# EAGLE design pcb-bldc-servo (EAGLE 9.6.2)
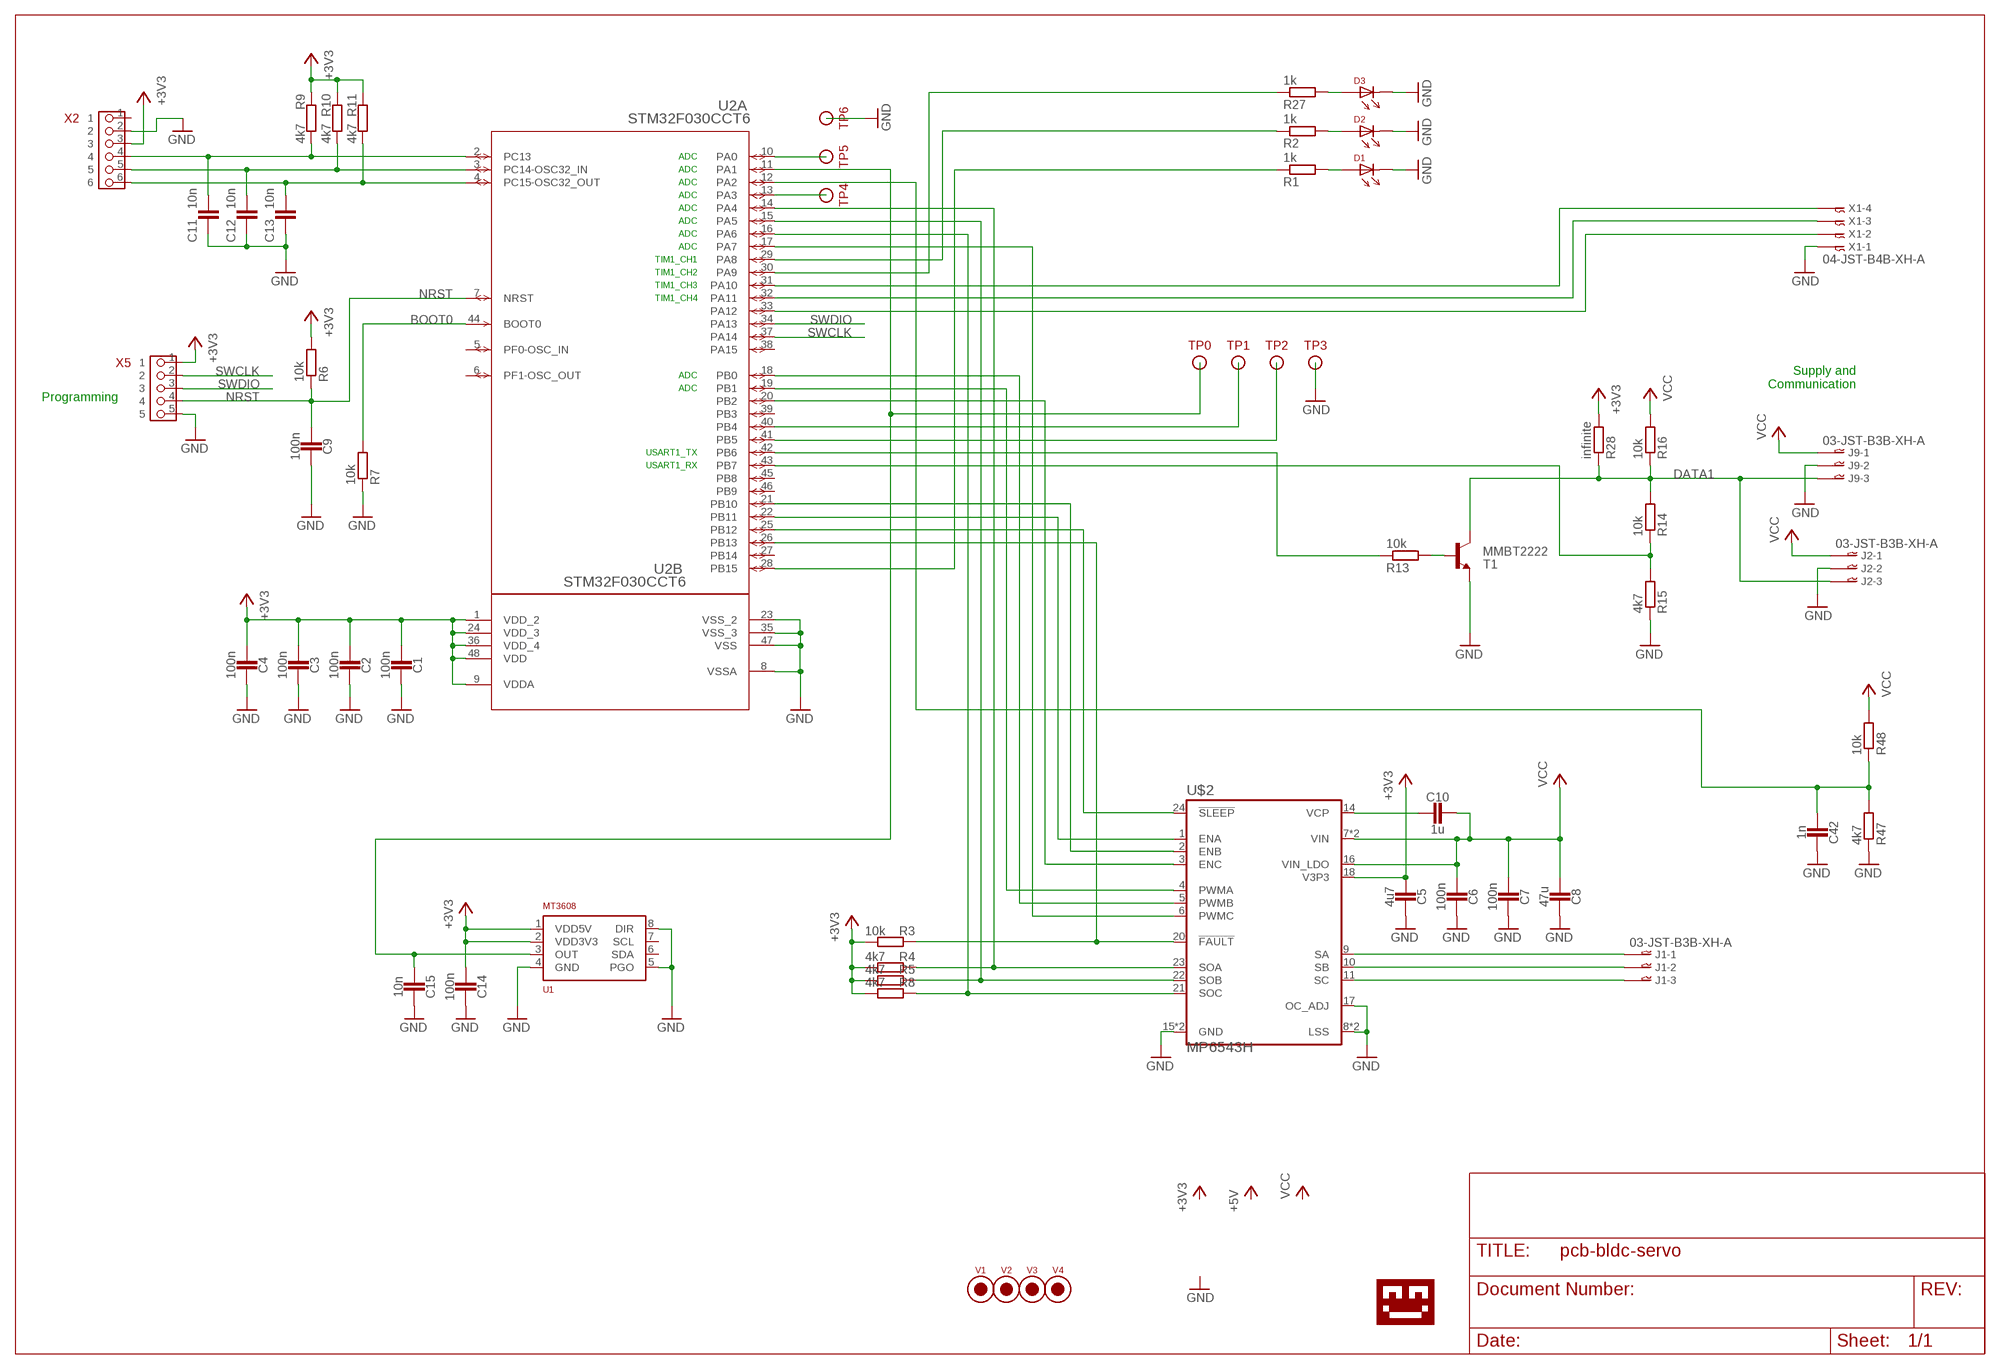
[diagram p0: schematic, sheet 1]

## Parts
C1  100n  CAPACITOR0603_CAP  [0603_CAP]
C2  100n  CAPACITOR0603_CAP  [0603_CAP]
C3  100n  CAPACITOR0603_CAP  [0603_CAP]
C4  100n  CAPACITOR0603_CAP  [0603_CAP]
C5  4u7  CAPACITOR0805_CAP  [0805_CAP]
C6  100n  CAPACITOR0603_CAP  [0603_CAP]
C7  100n  CAPACITOR0603_CAP  [0603_CAP]
C8  47u  CAPACITOR1210_CAP  [1210_CAP]
C9  100n  CAPACITOR0603_CAP  [0603_CAP]
C10  1u  CAPACITOR0603_CAP  [0603_CAP]
C11  10n  CAPACITOR0603_CAP  [0603_CAP]
C12  10n  CAPACITOR0603_CAP  [0603_CAP]
C13  10n  CAPACITOR0603_CAP  [0603_CAP]
C14  100n  CAPACITOR0603_CAP  [0603_CAP]
C15  10n  CAPACITOR0603_CAP  [0603_CAP]
C42  1n  CAPACITOR0603_CAP  [0603_CAP]
D1  LED-0805  [0805-DOT]
D2  LED-0805  [0805-DOT]
D3  LED-0805  [0805-DOT]
J1  03-JST-B3B-XH-A  [B3B-XH]
J2  03-JST-B3B-XH-A  [B3B-XH]
J9  03-JST-B3B-XH-A  [B3B-XH]
R1  1k  RESISTOR0603_RES  [0603-RES]
R2  1k  RESISTOR0603_RES  [0603-RES]
R3  10k  RESISTOR0603_RES  [0603-RES]
R4  4k7  RESISTOR0603_RES  [0603-RES]
R5  4k7  RESISTOR0603_RES  [0603-RES]
R6  10k  RESISTOR0603_RES  [0603-RES]
R7  10k  RESISTOR0603_RES  [0603-RES]
R8  4k7  RESISTOR0603_RES  [0603-RES]
R9  4k7  RESISTOR0603_RES  [0603-RES]
R10  4k7  RESISTOR0603_RES  [0603-RES]
R11  4k7  RESISTOR0603_RES  [0603-RES]
R13  10k  RESISTOR0603_RES  [0603-RES]
R14  10k  RESISTOR0603_RES  [0603-RES]
R15  4k7  RESISTOR0603_RES  [0603-RES]
R16  10k  RESISTOR0603_RES  [0603-RES]
R27  1k  RESISTOR0603_RES  [0603-RES]
R28  infinite  RESISTOR0603_RES  [0603-RES]
R47  4k7  RESISTOR0603_RES  [0603-RES]
R48  10k  RESISTOR0603_RES  [0603-RES]
T1  MMBT2222  MMBT2222ALT1-NPN-SOT23-BEC  [SOT23-BEC]
TP0  TESTPIN  [PIN-SMD-1X1-TEST_1M5]
TP1  TESTPIN  [PIN-SMD-1X1-TEST_1M5]
TP2  TESTPIN  [PIN-SMD-1X1-TEST_1M5]
TP3  TESTPIN  [PIN-SMD-1X1-TEST_1M5]
TP4  TESTPIN  [PIN-SMD-1X1-TEST_1M5]
TP5  TESTPIN  [PIN-SMD-1X1-TEST_1M5]
TP6  TESTPIN  [PIN-SMD-1X1-TEST_1M5]
U1  AS5600  [SOIC-8]
U2  STM32F030CCT6  [LQFP48-7X7MM]
U$1  LOGO-TOBENG-1MM-FINISH  [TOBENG-1MM-FINISH]
U$2  MP6543H  [QFN24]
V1  FIDUCIAL2MM  [FIDUCIAL_2MM]
V2  FIDUCIAL2MM  [FIDUCIAL_2MM]
V3  FIDUCIAL2MM  [FIDUCIAL_2MM]
V4  FIDUCIAL2MM  [FIDUCIAL_2MM]
X1  04-JST-B4B-XH-A  [B4B-XH]
X2  PIN_6X1  [PIN_6X1_MOLEX_PICOBLADE]
X5  PIN_5X1HD  [PIN_5X1_HD]

## Nets
+3V3: C1.1 C2.1 C3.1 C4.1 C5.P$1 C14.1 R3.2 R4.2 R5.2 R6.2 R8.2 R9.1 R10.1 R11.1 R28.2 U1.1(VDD5V) U1.2(VDD3V3) U2.1(B:VDD_2) U2.9(B:VDDA) U2.24(B:VDD_3) U2.36(B:VDD_4) U2.48(B:VDD) U$2.18(V3P3) X2.3 X5.1
BOOT0: R7.2 U2.44(A:BOOT0)
DATA1 [power]: J2.P$3 J9.P$3 R14.2 R16.1 R28.1 T1.C
GND: C1.2 C2.2 C3.2 C4.2 C5.P$2 C6.2 C7.2 C8.2 C9.2 C11.2 C12.2 C13.2 C14.2 C15.2 C42.2 D1.2 D2.2 D3.2 J2.P$2 J9.P$2 R7.1 R15.1 R47.1 T1.E TP3.1 TP6.1 U1.4(GND) U1.5(PGO) U1.8(DIR) U2.8(B:VSSA) U2.23(B:VSS_2) U2.35(B:VSS_3) U2.47(B:VSS) U$2.8(LSS) U$2.12(LSS) U$2.15(GND) U$2.17(OC_ADJ) U$2.25(GND) X1.P$1 X2.2 X5.5
M3B1: C42.1 R47.2 R48.1 U2.12(A:PA2)
N$1: U2.20(A:PB2) U$2.3(ENC)
N$2: U2.21(A:PB10) U$2.2(ENB)
N$3: U2.22(A:PB11) U$2.1(ENA)
N$4: D1.1 R1.2
N$5: U2.17(A:PA7) U$2.6(PWMC)
N$6: U2.18(A:PB0) U$2.5(PWMB)
N$7: D2.1 R2.2
N$8: R27.1 U2.30(A:PA9)
N$9: U2.19(A:PB1) U$2.4(PWMA)
N$10: R2.1 U2.29(A:PA8)
N$11: D3.1 R27.2
N$12: R13.1 U2.42(A:PB6)
N$13: R14.1 R15.2 U2.43(A:PB7)
N$14: R13.2 T1.B
N$15 [power]: J1.P$1 U$2.9(SA)
N$16 [power]: J1.P$2 U$2.10(SB)
N$17 [power]: J1.P$3 U$2.11(SC)
N$18: R8.1 U2.16(A:PA6) U$2.21(SOC)
N$19: R5.1 U2.15(A:PA5) U$2.22(SOB)
N$20: R4.1 U2.14(A:PA4) U$2.23(SOA)
N$21: U2.25(A:PB12) U$2.24(!SLEEP)
N$22: R3.1 U2.26(A:PB13) U$2.20(!FAULT)
N$23: U2.33(A:PA12) X1.P$2
N$24: C13.1 R11.2 U2.4(A:PC15-OSC32_OUT) X2.6
N$25: C12.1 R10.2 U2.3(A:PC14-OSC32_IN) X2.5
N$26: R1.1 U2.28(A:PB15)
N$27 [power]: C10.1 U$2.14(VCP)
N$28: C11.1 R9.2 U2.2(A:PC13) X2.4
N$29: U2.32(A:PA11) X1.P$3
N$30: U2.31(A:PA10) X1.P$4
N$31: TP1.1 U2.40(A:PB4)
N$32: C15.1 TP0.1 U1.3(OUT) U2.11(A:PA1)
N$33: TP2.1 U2.41(A:PB5)
N$34: TP4.1 U2.13(A:PA3)
N$35: TP5.1 U2.10(A:PA0)
NRST: C9.1 R6.1 U2.7(A:NRST) X5.4
SWCLK: U2.37(A:PA14) X5.2
SWDIO: U2.34(A:PA13) X5.3
VCC [power]: C6.1 C7.1 C8.1 C10.2 J2.P$1 J9.P$1 R16.2 R48.2 U$2.7(VIN) U$2.13(VIN) U$2.16(VIN_LDO)
Unconnected: U1.6(SDA) U1.7(SCL) U2.5(A:PF0-OSC_IN) U2.6(A:PF1-OSC_OUT) U2.27(A:PB14) U2.38(A:PA15) U2.39(A:PB3) U2.45(A:PB8) U2.46(A:PB9) X2.1

## Notes on the sheet
- ADC
- ADC
- ADC
- ADC
- ADC
- ADC
- ADC
- ADC
- TIM1_CH1
- TIM1_CH2
- TIM1_CH3
- TIM1_CH4
- ADC
- ADC
- Supply and
  Communication
- Programming
- USART1_TX
- USART1_RX

## Library data of the parts
C1-C15 C42 = passives:CAPACITOR: SMD Capacitor
D1-D3 = ftobler:LED
J1 J2 J9 = bt_con-jst-xh:03-JST: JST CONNECTOR
R1-R11 R13-R16 R27 R28 R47 R48 = passives:RESISTOR: Resistor Basic schematic elements and footprints for 0201, 0402, 0603, 1206, and PTH resistors.
T1 = transistor:*-NPN-: NPN Transistror BF959 corrected 2008.03.06
TP0 TP1-TP6 = ftobler:TESTPIN
U1 = ftobler:AS5600
U2 = stm32:STM32F030CCT6; BUILT_BY: EMA_Jessica; COPYRIGHT: Copyright (C) 2018 Accelerated Designs. All rights reserved; MANUFACTURER_PART_NUMBER: STM32F030CCT6; SOURCELIBRARY: STMicroelectronics_2020-10-07; VENDOR: STMicroelectronics
U$1 = ftobler:LOGO
U$2 = ftobler:MP6543H
V1-V4 = ftobler:FIDUCIAL
X1 = bt_con-jst-xh:04-JST: JST CONNECTOR
X2 = ftobler-conn:PIN_6X1
X5 = ftobler-conn:PIN_5X1

## Net classes
1 power: clearance 0.3 mm to class 0

## Board
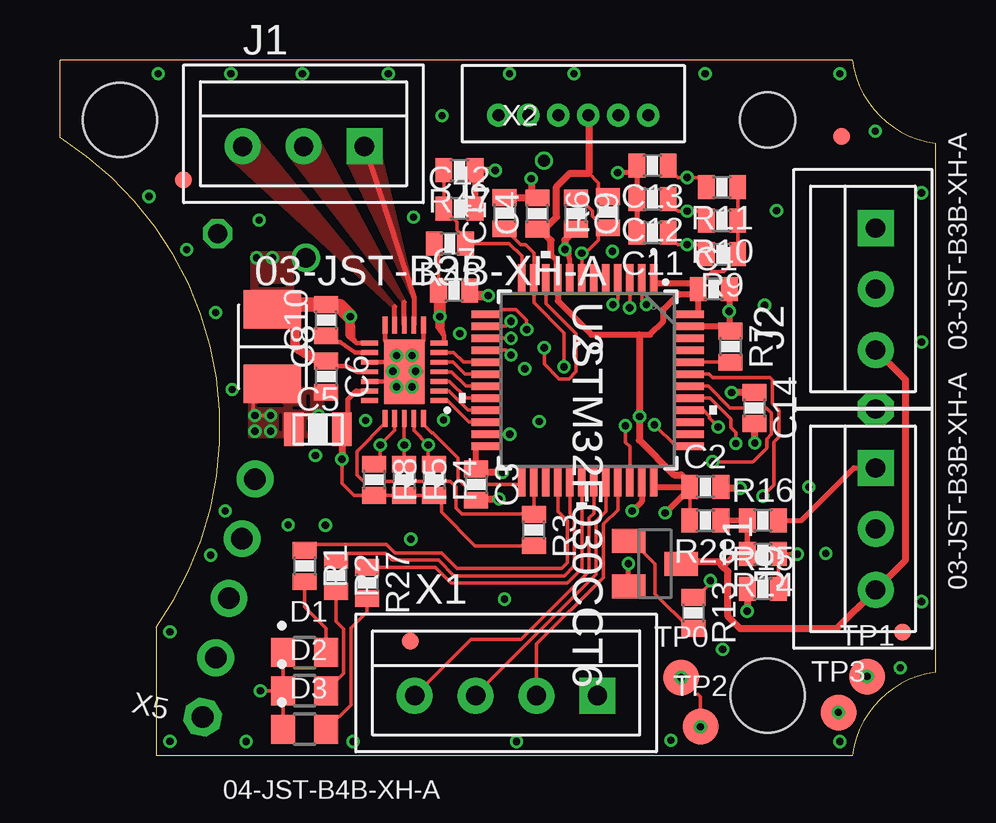
[diagram p1: board, top side]
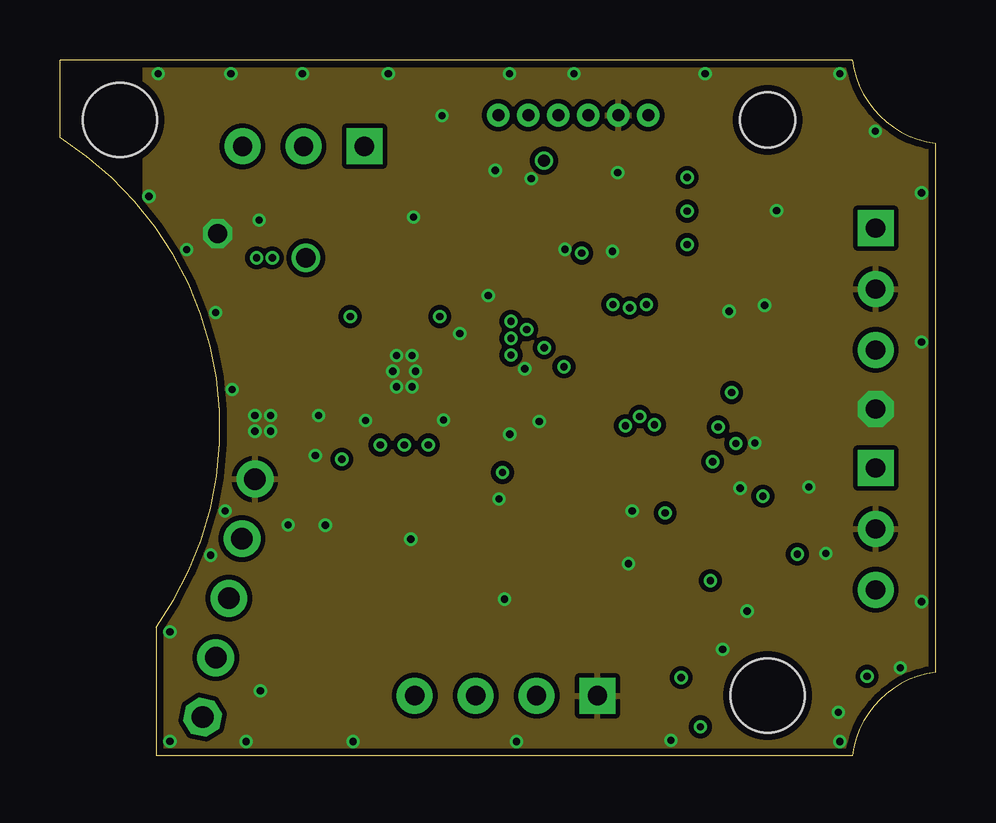
[diagram p2: board, inner layer Route2]
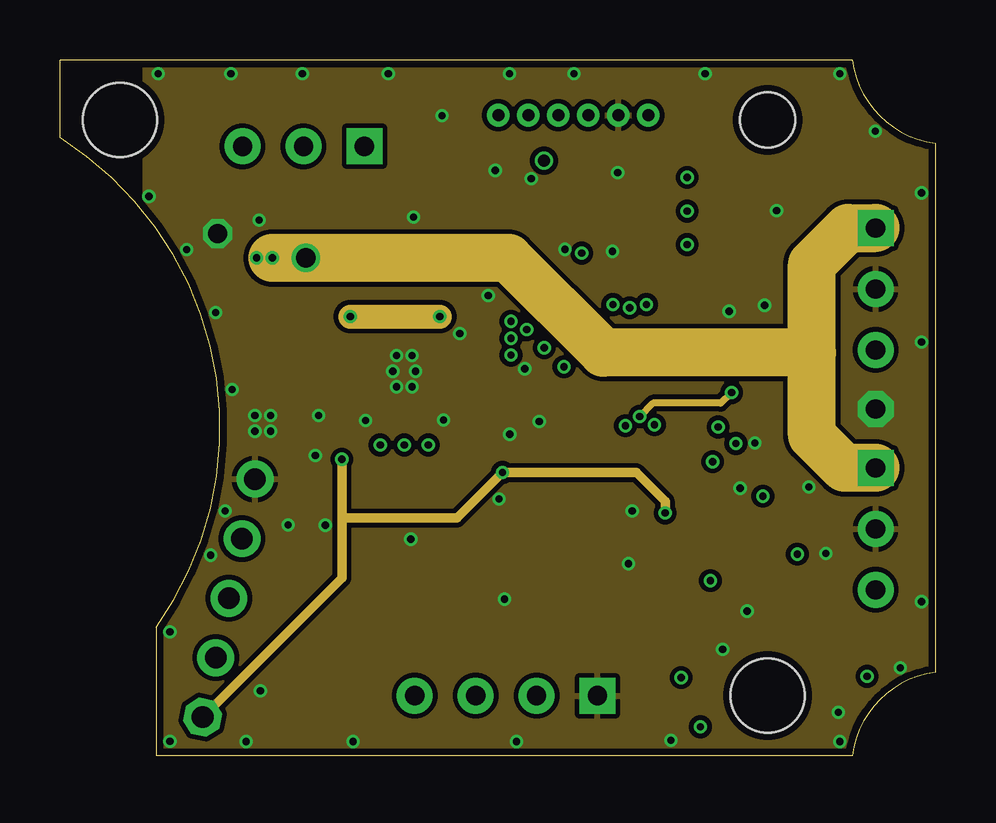
[diagram p3: board, inner layer Route15]
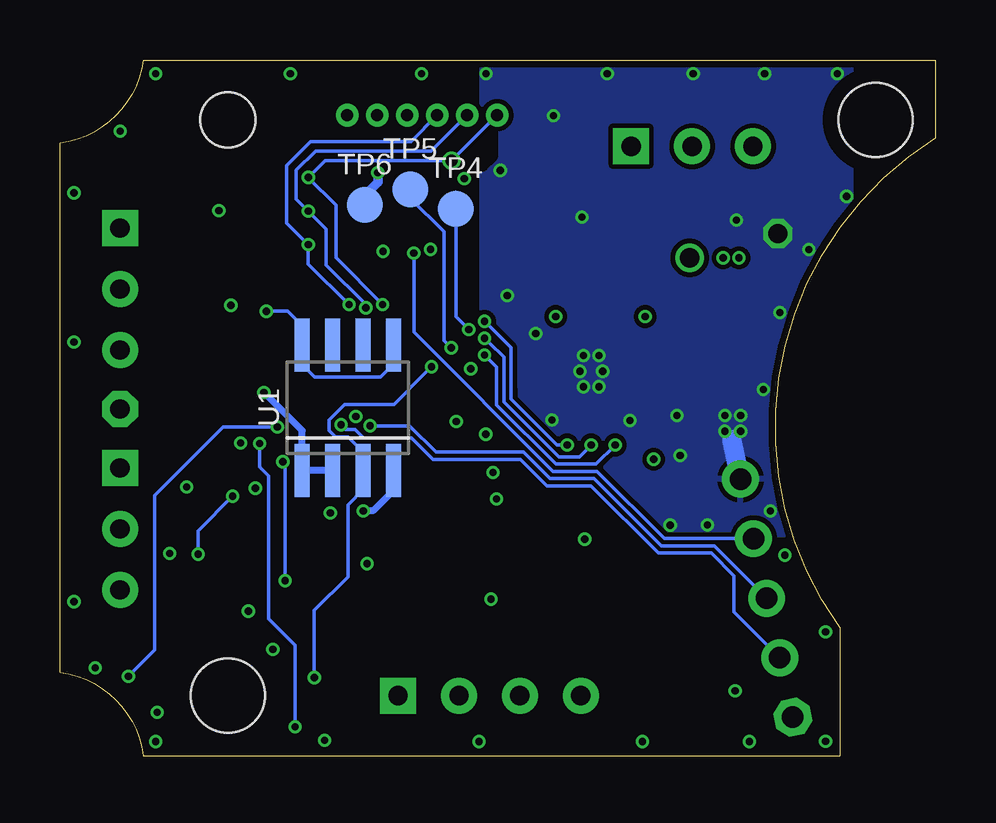
[diagram p4: board, bottom side, seen from below]

Size 36.5 x 29 mm. Coordinates in mm from the lower left corner, seen from the top.
Outline: 36.5,3.47 arc76 33.03,0 4,0 4,5.34 arc93 0,25.76 0,29 33.03,29 arc76 36.5,25.53 36.5,3.47
Copper layers (1+2*15+16): Top 0.035mm / dielectric 0.2mm / Route2 0.035mm / dielectric 0.4mm / Route15 0.035mm / dielectric 0.2mm / Bottom 0.035mm
Design rules "default *": minimum track width 0.15mm, minimum drill 0.2mm, track to track 0.15mm, track to pad 0.15mm, pad to pad 0.15mm, via to via 0.15mm, smd to smd 0.15mm, copper to edge 0.3mm, drill to drill 10mil, minimum pad ring 0.125mm, minimum via ring 0.125mm, stop-mask expansion 0.05mm, vias tented up to drill 0.35mm, thermal gap 0.2mm
Holes 3.1 mm at 2.5,26.5 29.5,2.5
Holes 2.3 mm at 29.5,26.5
tRestrict: 6 lines
bRestrict: area 0.5,24.5 to 4.5,28.5; 3 lines

### Footprints (pad centres in the part's own frame; a part is rotated, then mirrored left to right if it is on the bottom)
0603_CAP = smd 0.7 x 1: 1 -0.65,0; 2 0.65,0
0805_CAP = smd 0.8 x 1.4: P$1 1,0; P$2 -1,0
1210_CAP = smd 1.6 x 2.4: 1 -1.55,0; 2 1.55,0
0805-DOT = smd 1 x 1.2: 1 0.9,0; 2 -0.9,0
B3B-XH = drill 0.8 pad 1.5 square: P$1 2.54,0 | drill 0.8 pad 1.5: P$2 0,0; P$3 -2.54,0
0603-RES = smd 0.7 x 1: 1 -0.65,0; 2 0.65,0
SOT23-BEC = smd 1 x 1.4: B -0.95,-1.1; C 0,1.1; E 0.95,-1.1
PIN-SMD-1X1-TEST_1M5 = smd 1.5 x 1.5: 1 0,0
SOIC-8 = smd 0.61 x 2.21: 1 -1.905,-2.616; 2 -0.635,-2.616; 3 0.635,-2.616; 4 1.905,-2.616; 5 1.905,2.616; 6 0.635,2.616; 7 -0.635,2.616; 8 -1.905,2.616
LQFP48-7X7MM = smd 1.194 x 0.305: 1 -4.25,2.75; 2 -4.25,2.25; 3 -4.25,1.75; 4 -4.25,1.25; 5 -4.25,0.75; 6 -4.25,0.25; 7 -4.25,-0.25; 8 -4.25,-0.75; 9 -4.25,-1.25; 10 -4.25,-1.75; 11 -4.25,-2.25; 12 -4.25,-2.75; 25 4.25,-2.75; 26 4.25,-2.25; 27 4.25,-1.75; 28 4.25,-1.25; 29 4.25,-0.75; 30 4.25,-0.25; 31 4.25,0.25; 32 4.25,0.75; 33 4.25,1.25; 34 4.25,1.75; 35 4.25,2.25; 36 4.25,2.75 | smd 0.305 x 1.194: 13 -2.75,-4.25; 14 -2.25,-4.25; 15 -1.75,-4.25; 16 -1.25,-4.25; 17 -0.75,-4.25; 18 -0.25,-4.25; 19 0.25,-4.25; 20 0.75,-4.25; 21 1.25,-4.25; 22 1.75,-4.25; 23 2.25,-4.25; 24 2.75,-4.25; 37 2.75,4.25; 38 2.25,4.25; 39 1.75,4.25; 40 1.25,4.25; 41 0.75,4.25; 42 0.25,4.25; 43 -0.25,4.25; 44 -0.75,4.25; 45 -1.25,4.25; 46 -1.75,4.25; 47 -2.25,4.25; 48 -2.75,4.25
QFN24 = smd 0.7 x 0.2: 1 -1.45,1.2; 2 -1.45,0.8; 3 -1.45,0.4; 4 -1.45,0; 5 -1.45,-0.4; 6 -1.45,-0.8; 7 -1.45,-1.2; 13 1.45,-1.2; 14 1.45,-0.8; 15 1.45,-0.4; 16 1.45,0; 17 1.45,0.4; 18 1.45,0.8; 19 1.45,1.2 | smd 0.2 x 0.7: 8 -0.8,-1.95; 9 -0.4,-1.95; 10 0,-1.95; 11 0.4,-1.95; 12 0.8,-1.95; 20 0.8,1.95; 21 0.4,1.95; 22 0,1.95; 23 -0.4,1.95; 24 -0.8,1.95 | smd 1.7 x 2.7: 25 0,0
FIDUCIAL_2MM = smd 0.7 x 0.7: V 0,0
B4B-XH = drill 0.8 pad 1.5 square: P$1 3.81,0 | drill 0.8 pad 1.5: P$2 1.27,0; P$3 -1.27,0; P$4 -3.81,0
PIN_6X1_MOLEX_PICOBLADE = drill 0.5 pad 0.95: 1 -3.125,0; 2 -1.875,0; 3 -0.625,0; 4 0.625,0; 5 1.875,0; 6 3.125,0
PIN_5X1_HD = drill 0.9 pad 1.54 octagon: 1 0,0 | drill 0.9 pad 1.54: 2 0,-2.54; 3 0,-5.08; 4 0,-7.62; 5 0,-10.16

### Placement (x,y rotation side)
C1  27.25,19.45 0 top
C2  26.9,11.2 0 top
C3  17.35,11.3 270 top
C4  19.9,22.6 90 top
C5  10.75,13.6 0 top
C6  11.1,15.8 270 top
C7  16.43,19.39 0 top
C8  8.85,17.05 270 top
C9  21.5,22.6 270 top
C10  11.1,18.15 90 top
C11  24.7,21.8 180 top
C12  24.7,23.2 180 top
C13  24.7,24.6 180 top
C14  28.94,14.49 270 top
C15  18.54,22.61 90 top
C42  16.65,22.8 0 top
D1  10.2,4.3 0 top
D2  10.2,2.7 0 top
D3  10.2,1.1 0 top
J1  10.15,25.4 0 top
J2  34,19.45 90 top
J9  34,9.45 90 top
R1  10.2,7.9 270 top
R2  11.5,7.5 270 top
R3  19.75,9.4 270 top
R4  15.6,11.5 270 top
R5  14.35,11.5 270 top
R6  22.85,22.65 90 top
R7  27.95,17.05 270 top
R8  13.1,11.5 270 top
R9  27.6,20.9 180 top
R10  27.6,22.3 180 top
R11  27.6,23.7 180 top
R13  26.4,5.95 270 top
R14  29.3,8.4 180 top
R15  29.3,6.95 0 top
R16  29.3,9.8 0 top
R27  12.8,7.2 270 top
R28  26.9,9.8 180 top
R47  16.65,24.4 180 top
R48  16.25,21.35 180 top
T1  24.8,8 270 top
TP0  25.9,3.25 0 top
TP1  33.65,3.3 0 top
TP2  26.7,1.2 0 top
TP3  32.45,1.8 0 top
TP4  20,22.8 0 bottom
TP5  21.9,23.6 0 bottom
TP6  23.8,22.95 0 bottom
U1  24.5,14.5 0 bottom
U2  22,15.65 270 top
U$1  16.8,14.5 0 bottom
U$2  14.35,16 180 top
V1  5.14,24.01 0 top
V2  32.58,25.81 0 top
V3  35.13,5.14 0 top
V4  14.6,4.77 0 top
X1  18.6,2.5 0 top
X2  21.4,26.7 180 top
X5  5.95,1.6 167.6 top

### Tracks (layer width: path | path; a pad name or v marks a point on that pad's centre or on a via)
+3V3  (via drill 0.3)
  Top 0.15: R28.2 C2.1 | R11.1 R10.1 R9.1 28.25,20.75 27.68,20.18 27.18,20.18 26.6,19.6 C1.1 | v11.75,12.35 11.75,11.35 12.25,10.85 R8.2 R5.2 R4.2 15.75,10.85 15.9,10.7 15.9,10.15 17.3,8.75 R3.2 | 22.75,23.3 R6.2 22.6,23.3 22.45,23.45 22.45,23.88 22.05,24.27 | U2.1 24.75,19.7 | 20.5,20.85 20.49,20.86 20.48,20.86
  Top 0.2: U2.9 20.7,19.95 20.7,20.65 20.5,20.85 | 20.48,20.86 20.49,20.84 | C5.P$1 12,13.85 12,14.85 12.35,15.2 U$2.18
  Top 0.25: U2.48 26.6,18.4 26.6,19.25 25.8,19.25 25.15,18.6 25.15,18.1 24.6,17.55 24.15,17.55 22.15,17.55 20.75,18.95 U2.9 | C1.1 26.35,19.7 24.75,19.7 | U2.36 24.75,11.25 24.8,11.2 C2.1 26.25,11.14 v25.23,10.12 | C3.1 17.35,12.9 U2.24
  Top 0.3: v18.45,11.8 17.5,11.8 C3.1 | C5.P$1 v11.75,12.35 | C1.1 26.6,19.25 | 24.15,17.55 24.15,14.12 | 24.15,14.12 24.15,13.15 25.6,11.7 25.9,11.7 26.25,11.35 C2.1 | C14.1 v28,15.14 | 24.15,14.12 v24.17,14.14 | 20.48,20.86 20.48,21.48 20,21.95 C4.1 20.2,21.95 20.7,22.45 20.7,23.72 21.25,24.27 22.05,24.27 22.05,26.68 X2.3
  Route15 0.3: v24.17,14.14 24.72,14.69 27.55,14.69 v28,15.14
  Route15 0.4: X5.1 11.75,7.4 11.75,9.9 | 11.75,9.9 v11.75,12.35 | 11.75,9.9 16.55,9.9 v18.45,11.8 24.03,11.8 25.23,10.6 v25.23,10.12
  Bottom 0.3: U1.2 U1.1 26.41,13.54 v28,15.14
BOOT0
  Top 0.15: U2.44 R7.2
DATA1
  Top 0.22: R28.1 R16.1 R14.2 28.17,8.4 27.64,7.88
  Top 0.3: 25.98,8.08 T1.C 25.98,8.07 27.45,8.07 27.64,7.88 27.85,7.67 27.85,5.8 28.35,5.3 32.39,5.3 J9.P$3 35.25,8.16 35.25,15.66 J2.P$3
GND  (via drill 0.3, 0.8 pad 1.2, 0.8 pad 1.5)
  Top 0.15: D1.2 D2.2 | D2.2 D3.2 | D2.2 v8.35,2.7 | C2.2 27.6,11.15 | v8.78,14.17 v8.13,14.17 8.05,14.25 8.05,15.06 8.49,15.5 C8.2 | U$2.25 13.9,16 v13.88,16.02
  Top 0.18: 14.18,16.18 13.95,16.4 U$2.15 | 14.18,16.18 U$2.25 14.35,15.95 14,15.6 U$2.17 | U$2.12 13.55,17.3 14.1,16.75 | 14.18,16.18 14.18,16.68 14.1,16.75 | U$2.8 15.15,17.3 14.6,16.75 14.1,16.75 | C7.2 17.08,19.24
  Top 0.2: U2.23 v18.75,13.4 | C11.2 C12.2 C13.2 23.75,24.3 v23.25,24.3 | T1.E v23.7,8 | U2.8 21.25,20.71 21.23,20.73 21.23,20.93 v21.05,21.1 | 27.85,17.8 R7.1
  Top 0.25: U2.47 27.75,17.9 27.85,17.8 | R7.1 27.9,17.75 v27.9,18.52 C1.2 | U2.35 24.25,10.6 v23.85,10.2 | v18.15,24.4 R47.1 C42.2
  Top 0.3: R15.1 v28.65,6.03 | C3.2 17.4,10.7 v18.3,10.7 | 27.6,11.15 v28.35,11.15 | v19.65,24.05 19.65,23.5 C4.2 C15.2 | C9.2 21.05,21.5 v21.05,21.1 | C14.2 28.99,13.79 28.99,13.76 28.97,13.74 v28.97,13.03
  Top 0.4: C7.2 17.3,19.18 v17.85,19.18
  Bottom 0.15: U1.5 22.59,16.32 23.13,15.79 25.89,15.79 26.41,16.3 U1.8 26.41,17.93 27,18.52 v27.9,18.52
  Bottom 0.3: U1.4 22.59,11.05 23.45,10.2 v23.85,10.2
  Bottom 0.4: TP6.1 23.8,23.35 23.25,23.9 v23.25,24.3
  Bottom 0.8: X5.5 8.49,13.18
  other vias: 14.03,16.67 14.68,16.67 14.83,16.02 14.68,15.37 14.03,15.37 8.78,13.52 8.13,13.52 10.78,14.17 3.71,23.31 7.13,28.42 15.93,26.67 26.9,28.42 29.88,22.72 33.99,26.03 35.92,17.23 31.93,8.42 35.03,3.65 32.52,0.58 27.63,4.42 19.03,0.58 14.63,9.02 11.07,9.6 19.98,13.92 7.76,0.58 4.59,5.15 6.5,18.46 23.03,21.02 29.38,18.77 19.38,16.12 18.53,6.52 5.29,21.09 6.29,8.35 4.59,0.59 6.89,10.19 16.67,17.59 14.75,22.44 8.31,22.32 12.22,0.58 25.47,0.63 35.92,6.41 31.22,11.19 35.92,23.45 32.52,28.42 21.43,28.42 13.69,28.42 7.18,15.25 4.1,28.42 10.11,28.42 18.74,28.42 12.74,13.97 10.65,12.51 15.99,13.99 9.51,9.61 34,14.45 6.57,21.76 32.45,1.8
  pour Route2 (isolate 0.2): 3.5,29.5 37,29.5 37,-0.5 3.5,-0.5
  pour Top (no thermals): 7.9,15.3 7.9,13.3 9.6,13.3 10.95,13.3 10.95,15.3
  pour Route15 (isolate 0.2): 3.5,29.5 37,29.5 37,-0.5 3.5,-0.5
  pour Bottom (isolate 0.2): 3.5,9.18 12.17,9.18 18.94,15.95 18.94,30.66 3.5,30.66
M3B1
  Top 0.15: R47.2 C42.1 16.03,22.78 C42.1 16.55,22.25 16.55,21.9 16.9,21.55 R48.1 18.73,21.35 19.25,20.83 U2.12
N$1
  Top 0.15: U$2.3 16.24,15.6 16.94,14.9 U2.20
N$2
  Top 0.15: U$2.2 16.22,15.2 17.02,14.4 U2.21
N$3
  Top 0.15: U$2.1 16.15,14.8 17.05,13.9 U2.22
N$4
  Top 0.15: R1.2 10.2,6.2 11.1,5.3 D1.1
N$5
  Top 0.15: U$2.6 16.41,16.8 16.82,16.4 U2.17
N$6
  Top 0.15: U$2.5 16.39,16.4 16.89,15.9 U2.18
N$7
  Top 0.15: D2.1 11.82,3.42 11.82,5.28 11.5,5.6 R2.2
N$8
  Top 0.15: R27.1 15.65,7.85 16.3,7.2 21.15,7.2 21.75,7.8 U2.30
N$9
  Top 0.15: U$2.4 16.32,16 16.92,15.4 U2.19
N$10
  Top 0.15: U2.29 21.25,10.1 21.45,9.9 21.45,7.92 21.03,7.5 16.42,7.5 15.77,8.15 13.85,8.15 13.57,8.43 11.78,8.43 R2.1
N$11
  Top 0.15: D3.1 12.12,2.12 12.12,5.33 12.8,6 R27.2
N$12  (via drill 0.3)
  Top 0.15: U2.42 27.03,15.4 27.93,14.5 29.45,14.5 29.66,14.28 29.66,13.4 29.47,13.2 29.47,12.83 28.89,12.25 v27.21,12.25 27.2,12.26 | v27.12,7.29 27.12,7.17 26.55,6.6 R13.1
  Bottom 0.15: v27.21,12.25 27.12,12.16 v27.12,7.29
N$13  (via drill 0.3)
  Top 0.15: R14.1 R15.2 | R14.1 29.95,8.54 | R14.1 v30.74,8.4 | U2.43 27.06,15.9 27.2,15.75 29.6,15.75 29.7,15.65 29.7,14.67 29.96,14.41 29.96,13.27 29.77,13.07 29.77,11.28 v29.3,10.81
  Bottom 0.15: v29.3,10.81 30.74,9.37 v30.74,8.4
N$14
  Top 0.15: T1.B 23.85,8.95 24.8,8 24.8,6.75 26.25,5.3 R13.2
N$15
  Top 0.2: U$2.9 14.75,19.1 J1.P$1
  pour Top (no thermals): 13.3,25.18 12.5,25.9 12.05,24.75 14.75,19.12
N$16
  Top 0.2: U$2.10 14.35,18.9
  pour Top (no thermals): 14.35,18.9 9.6,25.05 9.75,25.85 10.7,25.75
N$17
  Top 0.2: U$2.11 13.95,18.7
  pour Top (no thermals): 7.1,25 13.95,18.7 8.15,25.75 7.23,25.75
N$18  (via drill 0.3)
  Top 0.15: U$2.21 13.95,13.55 v13.35,12.95 13.35,12.4 R8.1 13.3,12.15 | U2.16 18.6,16.9 v18.8,16.7
  Bottom 0.15: v13.35,12.95 14.15,12.15 15.83,12.15 18.3,14.62 18.3,16.2 v18.8,16.7
N$19  (via drill 0.3)
  Top 0.15: U2.15 v18.8,17.4 | R5.1 v14.35,12.95 U$2.22
  Bottom 0.15: v14.35,12.95 14.85,12.45 15.56,12.45 15.7,12.45 18,14.75 18,14.89 18,16.61 18.59,17.2 18.6,17.2 v18.8,17.4
N$20  (via drill 0.3)
  Top 0.15: U$2.23 14.75,13.55 v15.35,12.95 15.35,12.4 R4.1 15.35,12.15 | U2.14 18.6,17.9 v18.8,18.1
  Bottom 0.15: v18.8,18.1 18.6,17.9 18.59,17.9 17.7,17.01 17.7,15.3 17.7,14.87 15.78,12.95 v15.35,12.95
N$21
  Top 0.15: U$2.24 15.15,13.8 15.5,13.45 15.56,13.45 16.6,12.41 16.6,11.53 16.83,11.3 19.25,11.3 U2.25
N$22
  Top 0.15: U2.26 R3.1 19.73,10.07 16.76,10.07 16.5,10.33 16.5,11.21 16.28,11.43 12.66,11.43 12.38,11.71 12.38,12.68 13.55,13.86 U$2.20
N$23
  Top 0.15: U2.33 23.25,10.25 22.65,9.65 22.65,8.12 22.65,7.43 19.87,4.65 X1.P$2
N$24  (via drill 0.3, 0.5)
  Top 0.15: C13.1 25.35,24.5 25.75,24.1 v26.15,24.1 26.7,24.1 26.95,23.85 R11.2 | U2.4 23.25,19 v23.05,18.8
  Bottom 0.15: v23.05,18.8 25,20.75 25,22.95 v26.15,24.1 25.45,24.8 v20.18,24.8 X2.6
N$25  (via drill 0.3)
  Top 0.15: C12.1 25.35,23.1 25.75,22.7 v26.15,22.7 26.7,22.7 26.95,22.45 R10.2 | U2.3 v23.75,18.67
  Bottom 0.15: v23.75,18.67 23.75,18.8 25.4,20.45 25.4,21.95 v26.15,22.7 26.65,23.2 26.65,24.4 25.85,25.2 21.02,25.2 X2.5
N$26
  Top 0.15: R1.1 10.35,8.55 10.6,8.8 13.62,8.8 13.97,8.45 15.9,8.45 16.55,7.8 20.9,7.8 21.15,8.05 21.15,9.78 20.75,10.18 U2.28
N$27
  Top 0.18: U$2.14 12.3,16.8 11.67,17.25 11.4,17.25 C10.1
N$28  (via drill 0.3)
  Top 0.15: C11.1 25.35,21.7 25.75,21.3 v26.15,21.3 26.7,21.3 26.95,21.05 R9.2 | U2.2 24.25,19 v24.45,18.8
  Bottom 0.15: v24.45,18.8 26.15,20.5 v26.15,21.3 27.05,22.2 27.05,24.6 26.05,25.6 21.88,25.6 X2.4
N$29
  Top 0.15: U2.32 22.75,10.17 22.35,9.77 22.35,7.55 17.75,2.95 17.75,2.92 X1.P$3
N$30
  Top 0.15: X1.P$4 17.14,4.85 19.22,4.85 22.05,7.68 22.05,9.9 22.25,10.1 U2.31
N$31  (via drill 0.3)
  Top 0.15: v27.44,13.7 27.07,14.07 27.07,14.15 26.82,14.4 U2.40
  Bottom 0.15: v27.44,13.7 29.7,13.7 32.55,10.85 32.55,4.4 TP1.1
  other vias: 33.65,3.3
N$32  (via drill 0.3)
  Top 0.15: v21.02,16.21 21.02,17.62 19.75,18.88 U2.11 19.75,20.95 19.4,21.3 19.2,21.3 C15.1
  Bottom 0.15: v21.02,16.21 21.39,15.84 22.58,14.64 24.64,14.64 25.28,14 25.28,13.55 25.01,13.28 24.49,13.28 23.86,12.65 U1.3 23.86,11.09 24.5,10.45 24.5,7.45 25.9,6.05 TP0.1
  other vias: 25.9,3.25
N$33  (via drill 0.3)
  Top 0.15: U2.41 27.1,14.9 27.97,14.04 27.97,13.68 28.18,13.46 v28.18,13.01 | TP2.1 26.7,2.45 26.59,2.56
  Bottom 0.15: v28.18,13.01 28.18,12.03 27.8,11.65 27.8,5.7 26.7,4.6 TP2.1
  other vias: 26.7,1.2
N$34  (via drill 0.3)
  Top 0.15: U2.13 18.2,18.4 18.4,18.6 19.01,18.6 19.46,18.15 v19.46,17.77
  Bottom 0.15: v19.46,17.77 20,18.31 TP4.1
N$35  (via drill 0.3)
  Top 0.15: U2.10 20.25,18.85 21.52,17.59 21.52,16 21.22,15.71 20.81,15.71 20.19,16.32 v20.19,17
  Bottom 0.15: TP5.1 21.9,23.25 20.5,21.85 20.5,17.31 v20.19,17
NRST  (via drill 0.3)
  Top 0.15: U2.7 v21.75,20.95 21.9,20.95 22.45,21.5 22.45,21.8 22.65,22 R6.1 | 22.75,22 R6.1 | C9.1 21.65,23.25 22.2,22.7 22.2,22.5 22.7,22 R6.1
  Bottom 0.15: v21.75,20.95 21.75,17.65 15.95,11.85 14.11,11.85 11.3,9.04 X5.4
SWCLK  (via drill 0.3)
  Top 0.15: v24.78,13.79 25.67,12.9 U2.37
  Bottom 0.15: X5.2 8.4,5.99 8.4,7.5 9.35,8.44 11.1,8.44 11.55,8.44 14.36,11.25 16.2,11.25 16.55,11.6 17.3,12.35 20.95,12.35 21.85,13.25 23.85,13.25 24.2,13.6 24.59,13.6 v24.78,13.79
SWDIO  (via drill 0.3)
  Top 0.15: v23.57,13.75 23.57,13.06 23.75,12.88 U2.34
  Bottom 0.15: X5.3 9.22,8.74 11.42,8.74 14.23,11.55 16.07,11.55 17.17,12.65 20.83,12.65 21.93,13.75 v23.57,13.75
VCC  (via drill 0.3, 0.8 pad 1.2)
  Top 0.15: 15.83,17.9 15.83,17.83 15.85,17.85 15.93,17.85 | 16,17.46 16,17.48 16,17.47 | R48.2 15.85,21.1 15.78,21.03 C7.1
  Top 0.18: U$2.16 12.4,16 11.9,16.25 11.3,16.25 C6.1 | U$2.13 12.37,17.2 | 12.1,17.55 12.1,17.47 12.22,17.43 | 12.37,17.2 12.22,17.43 | 16,17.46 16,17.2 15.94,17.2 U$2.7 | 16,17.48 15.83,17.83 | 12.21,17.9 12.22,17.43 | 15.93,17.85 16,17.48 | 16,17.47 15.73,17.87 | 12.37,17.2 12.03,17.47
  Top 0.2: R16.2 30.9,9.8 33.09,11.99 J9.P$1
  Top 0.4: C6.1 10.6,16.55 9.8,17.04 9.8,18.05 9.05,18.8 8.85,18.8 | 12.1,17.55 v12.1,18.3 | 11.15,18.75 C10.2 | 15.83,17.9 v15.83,18.3 | 15.83,19.34 C7.1
  Top 0.5: 8.85,18.8 C8.1 | v15.83,18.3 15.83,19.34
  Top 0.6: C10.2 8.85,18.8 | 11.15,18.75 11.65,18.75 v12.1,18.3
  Route15 1: v12.1,18.3 v15.83,18.3
  Route15 2: J9.P$1 32.7,11.99 31.35,13.34 31.35,16.8 | J2.P$1 32.85,21.99 31.35,20.49 31.35,16.8 | 31.35,16.8 22.65,16.8 18.7,20.75 v10.25,20.75 v8.85,20.75
  other vias: 8.2,20.75
  pour Top (no thermals): 8,20.95 8,18.45 9.7,18.45 9.7,20.95

### Text on the board
tStop: v2 | v1 | v4 | v3
bFinish: pcb-bldc-servo v1 / by ftobler 2022 | VCC | GND | DATA | GND | GND | VCC | RST | GND | DIO | DATA | CLK | EN | DIR | STEP | GND | 3V3